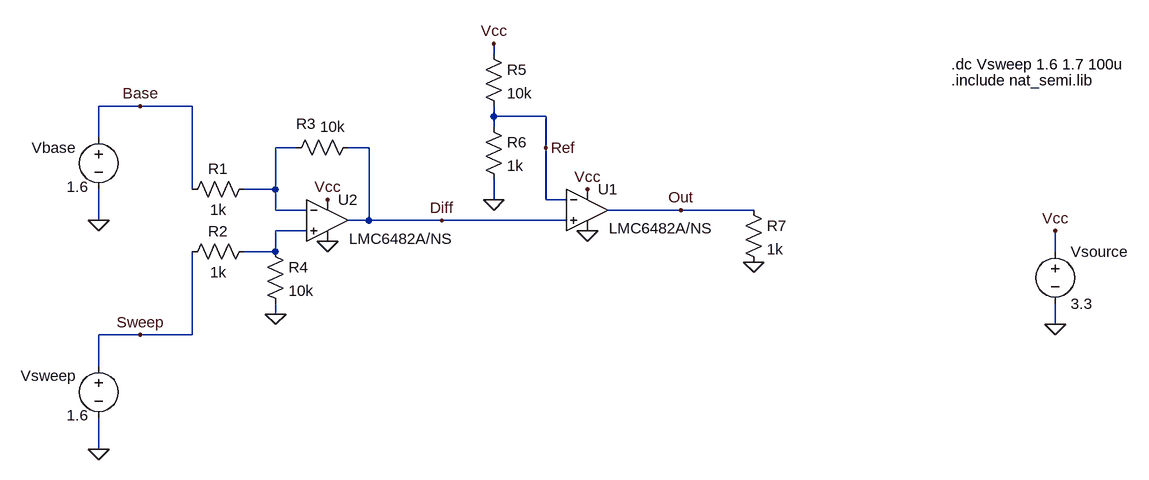
[diagram p0: schematic sim1.asc]
sim1.asc, the LTspice schematic file:
Version 4
SHEET 1 1400 680
WIRE 64 -704 64 -720
WIRE -480 -624 -544 -624
WIRE -400 -624 -480 -624
WIRE 64 -608 64 -624
WIRE 144 -608 64 -608
WIRE 64 -592 64 -608
WIRE -544 -576 -544 -624
WIRE -240 -560 -272 -560
WIRE -128 -560 -160 -560
WIRE 144 -560 144 -608
WIRE -400 -496 -400 -624
WIRE -272 -496 -272 -560
WIRE -272 -496 -320 -496
WIRE 64 -480 64 -512
WIRE 144 -480 144 -560
WIRE 176 -480 144 -480
WIRE -272 -464 -272 -496
WIRE -224 -464 -272 -464
WIRE 352 -464 240 -464
WIRE 464 -464 352 -464
WIRE -544 -448 -544 -496
WIRE -128 -448 -128 -560
WIRE -128 -448 -160 -448
WIRE -16 -448 -128 -448
WIRE 176 -448 -16 -448
WIRE -224 -432 -272 -432
WIRE -272 -400 -272 -432
WIRE -272 -400 -320 -400
WIRE 928 -400 928 -432
WIRE -272 -304 -272 -320
WIRE 928 -288 928 -320
WIRE -480 -272 -544 -272
WIRE -400 -272 -400 -400
WIRE -400 -272 -480 -272
WIRE -544 -224 -544 -272
WIRE -544 -96 -544 -144
FLAG 928 -432 Vcc
FLAG 928 -288 0
FLAG -192 -480 Vcc
FLAG -544 -448 0
FLAG -544 -96 0
FLAG -192 -416 0
FLAG -272 -304 0
FLAG -480 -624 Base
FLAG -480 -272 Sweep
FLAG -16 -448 Diff
FLAG 208 -496 Vcc
FLAG 208 -432 0
FLAG 64 -480 0
FLAG 64 -720 Vcc
FLAG 464 -384 0
FLAG 352 -464 Out
FLAG 144 -560 Ref
SYMBOL voltage 928 -416 R0
WINDOW 123 0 0 Left 2
WINDOW 39 0 0 Left 2
SYMATTR InstName Vsource
SYMATTR Value 3.3
SYMBOL Opamps\\opamp2 -192 -512 R0
WINDOW 3 33 92 Left 2
SYMATTR InstName U2
SYMATTR Value LMC6482A/NS
SYMBOL voltage -544 -592 R0
WINDOW 123 0 0 Left 2
WINDOW 39 0 0 Left 2
WINDOW 0 -103 32 Left 2
WINDOW 3 -49 92 Left 2
SYMATTR InstName Vbase
SYMATTR Value 1.6
SYMBOL res -304 -512 R90
WINDOW 0 0 56 VBottom 2
WINDOW 3 32 56 VTop 2
SYMATTR InstName R1
SYMATTR Value 1k
SYMBOL res -304 -416 R90
WINDOW 0 0 56 VBottom 2
WINDOW 3 32 56 VTop 2
SYMATTR InstName R2
SYMATTR Value 1k
SYMBOL res -144 -576 R90
WINDOW 0 -5 81 VBottom 2
WINDOW 3 -32 40 VTop 2
SYMATTR InstName R3
SYMATTR Value 10k
SYMBOL res -288 -416 R0
SYMATTR InstName R4
SYMATTR Value 10k
SYMBOL voltage -544 -240 R0
WINDOW 123 0 0 Left 2
WINDOW 39 0 0 Left 2
WINDOW 0 -120 31 Left 2
WINDOW 3 -49 92 Left 2
SYMATTR InstName Vsweep
SYMATTR Value 1.6
SYMBOL Opamps\\opamp2 208 -528 R0
WINDOW 3 33 92 Left 2
SYMATTR InstName U1
SYMATTR Value LMC6482A/NS
SYMBOL res 48 -720 R0
SYMATTR InstName R5
SYMATTR Value 10k
SYMBOL res 48 -608 R0
SYMATTR InstName R6
SYMATTR Value 1k
SYMBOL res 448 -480 R0
SYMATTR InstName R7
SYMATTR Value 1k
TEXT 768 -688 Left 2 !.dc Vsweep 1.6 1.7 100u
TEXT 768 -664 Left 2 !.include nat_semi.lib

The netlist it stands for:
* sim1.asc
Vsource Vcc 0 3.3
XU2 N002 N001 Vcc 0 Diff LMC6482A/NS  ; pins In+ In- V+ V- OUT
Vbase Base 0 1.6
R1 N001 Base 1k
R2 N002 Sweep 1k
R3 Diff N001 10k
R4 N002 0 10k
Vsweep Sweep 0 1.6
XU1 Diff Ref Vcc 0 Out LMC6482A/NS  ; pins In+ In- V+ V- OUT
R5 Vcc Ref 10k
R6 Ref 0 1k
R7 Out 0 1k
.dc Vsweep 1.6 1.7 100u
.include nat_semi.lib
.backanno
.end

* Results of the author's LTspice run, read from the files saved beside the schematic
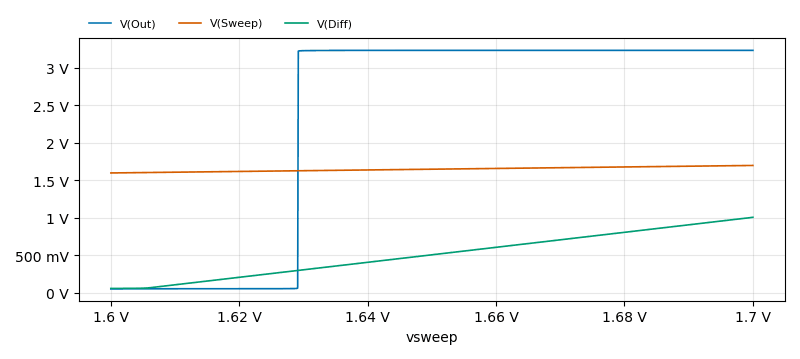
[diagram p1: DC transfer characteristic of sim1.asc, plotted from the saved traces]
* DC transfer characteristic, 1 run:
*   V(Out): 54.82 mV at vsweep=1.6 V, 3.235 V at vsweep=1.7 V, min 54.82 mV, max 3.235 V
*   V(Sweep): 1.6 V at vsweep=1.6 V, 1.7 V at vsweep=1.7 V, min 1.6 V, max 1.7 V
*   V(Diff): 58.94 mV at vsweep=1.6 V, 1.008 V at vsweep=1.7 V, min 58.94 mV, max 1.008 V